# EAGLE design SunnyBuddy (EAGLE 9.6.2)

## Sheet 1 of 4
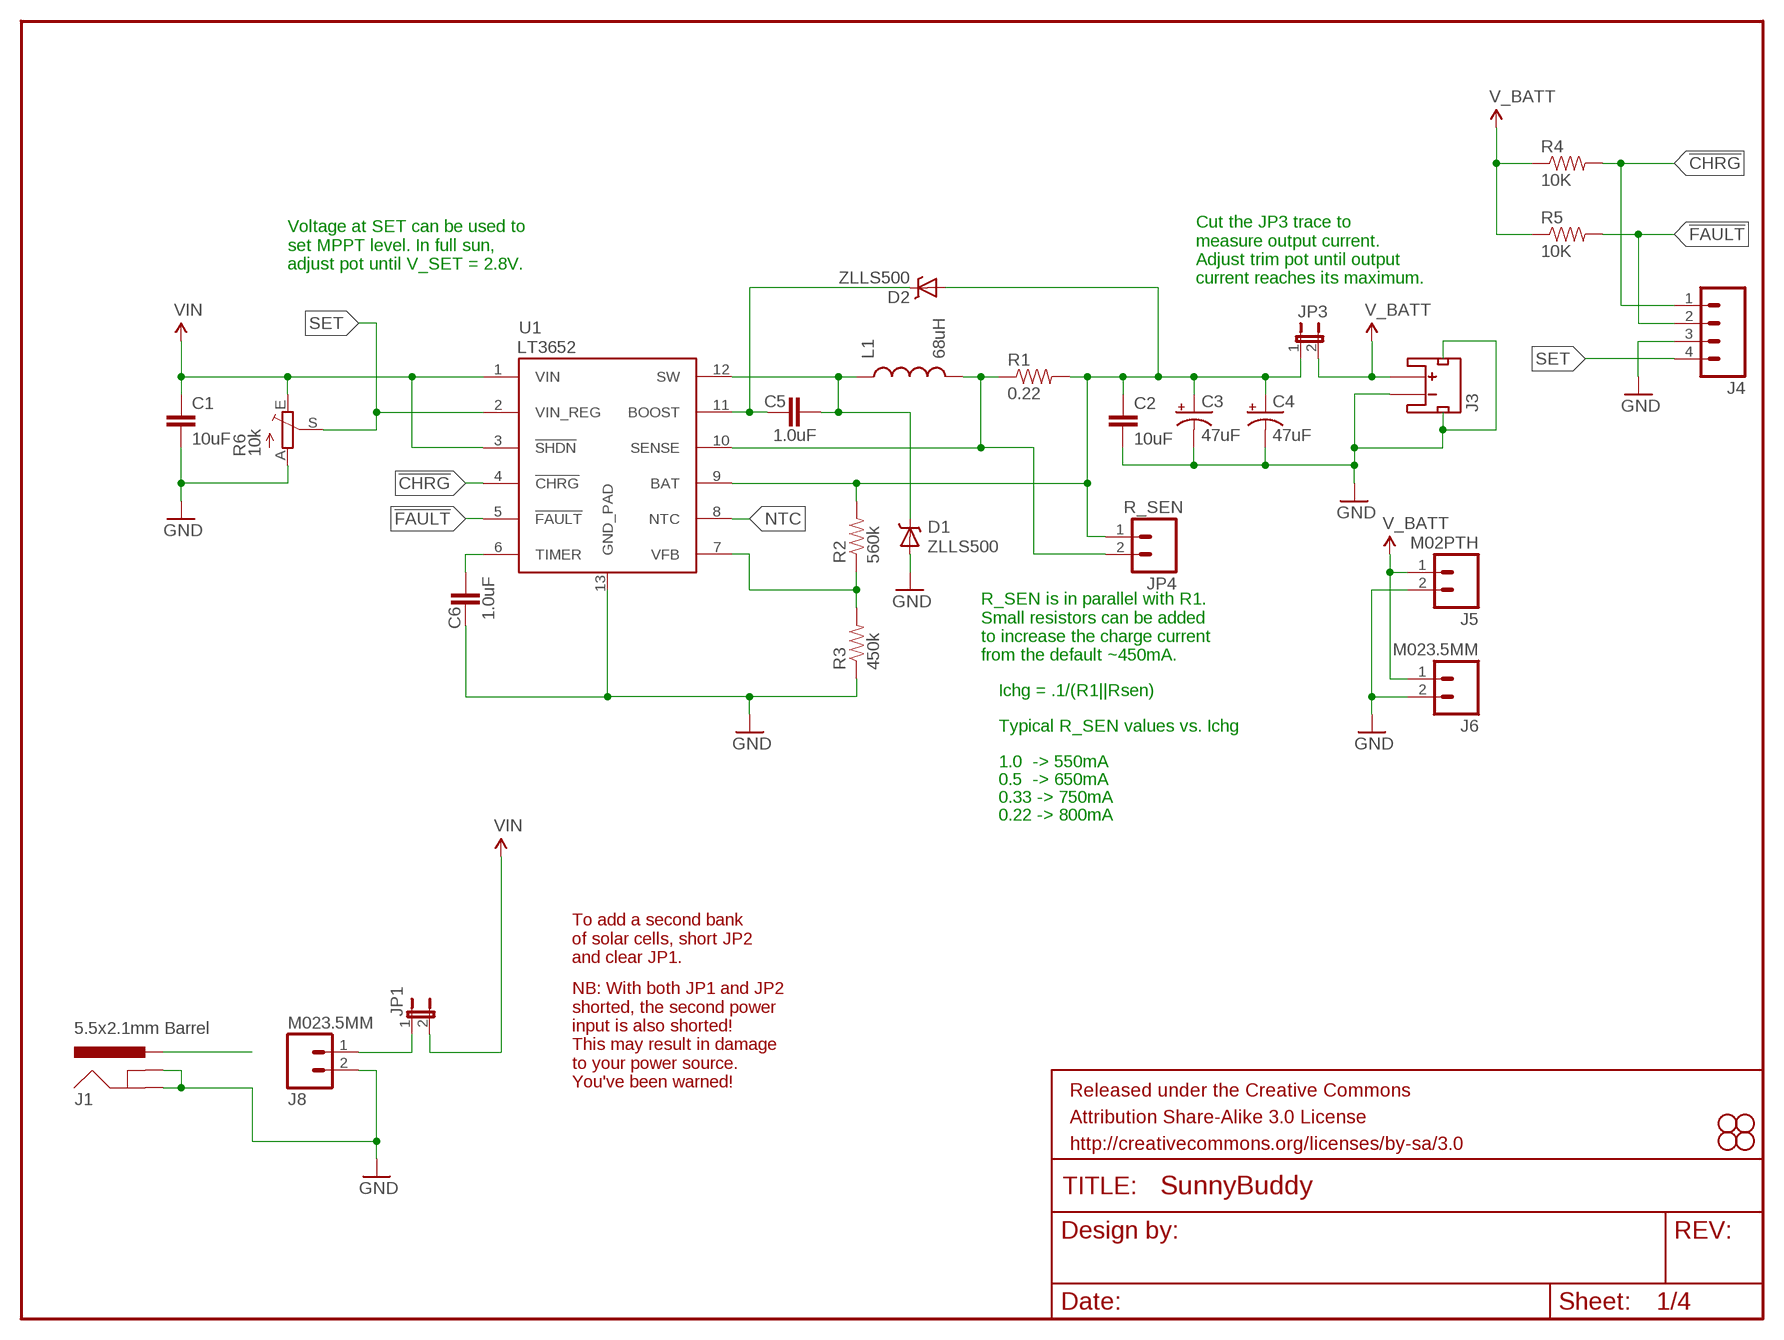
[diagram p0: schematic, sheet 1]

### Parts
C1  10uF  10UF50V20%(1210)  [1210]
C2  10uF  10UF-6.3V-20%(1206)  [1206]
C3  47uF  47UF-TANT  [EIA3528]
C4  47uF  47UF-TANT  [EIA3528]
C5  1.0uF  1.0UF-16V-10%(0603)  [0603-CAP]
C6  1.0uF  1.0UF-16V-10%(0603)  [0603-CAP]
D1  ZLLS500  ZLLS500ZLLS500  [SOT23]
D2  ZLLS500  ZLLS500ZLLS500  [SOT23]
FRAME1  FRAME-LETTER  [CREATIVE_COMMONS]
J1  5.5x2.1mm Barrel  POWER_JACKSMD  [POWER_JACK_SMD]
J3  JST_2MM_MALE  [JST-2-SMD]
J4  M04PTH  [1X04]
J5  M02PTH  [1X02]
J6  M023.5MM  [SCREWTERMINAL-3.5MM-2]
J8  M023.5MM  [SCREWTERMINAL-3.5MM-2]
JP1  JUMPER-2SMD-NC  [SJ_2S]
JP3  JUMPER-PTH-2-NC  [PTH-JUMPER-NC_BOTTOM_NO_SILK]
JP4  R_SEN  M02PTH  [1X02]
L1  68uH  INDUCTOR68UH-1A  [CR75]
R1  0.22  0.22OHM1/4W1%(0805)  [0805]
R2  560k  47KOHM1/10W1%(0603)  [0603-RES]
R3  450k  220KOHM1/10W1%(0603)  [0603-RES]
R4  10K  10KOHM1/10W1%(0603)0603  [0603-RES]
R5  10K  10KOHM1/10W1%(0603)0603  [0603-RES]
R6  10k  TRIM_EU-S63S  [S63S]
STANDOFF1  STAND-OFF  [STAND-OFF]
STANDOFF2  STAND-OFF  [STAND-OFF]
STANDOFF3  STAND-OFF  [STAND-OFF]
STANDOFF4  STAND-OFF  [STAND-OFF]
U1  LT3652  [MSOP-12_GND]

### Nets
!CHRG: J4.1 R4.2 U1.4(!CHRG)
!FAULT: J4.2 R5.2 U1.5(!FAULT)
BOOST: C5.1 D2.3(C) U1.11(BOOST)
FB: R2.1 R3.2 U1.7(VFB)
GND: C1.2 C2.2 C3.C(-) C4.C(-) C6.1 D1.1(A) J1.GND(GNDBREAK) J1.P$4(GND) J3.1(-) J3.NC1(PAD1) J3.NC2(PAD2) J4.3 J5.2 J6.2 J8.2 R3.1 R6.A U1.13(GND_PAD)
N$4: C2.1 C3.A(+) C4.A(+) D2.1(A) JP3.1 JP4.1 R1.2 R2.2 U1.9(BAT)
N$6: J1.VIN0(PWR)
N$8: J8.1 JP1.1
NTC: U1.8(NTC)
SENSE: JP4.2 L1.P$2 R1.1 U1.10(SENSE)
SET: J4.4 R6.S U1.2(VIN_REG)
SW: C5.2 D1.3(C) L1.P$1 U1.12(SW)
TIMER: C6.2 U1.6(TIMER)
V_BATT: J3.2(+) J5.1 J6.1 JP3.2 R4.1 R5.1
VIN: C1.1 JP1.2 R6.E U1.1(VIN) U1.3(!SHDN)

### Notes on the sheet
- Voltage at SET can be used to
  set MPPT level. In full sun,
  adjust pot until V_SET = 2.8V.
- Cut the JP3 trace to
  measure output current.
  Adjust trim pot until output
  current reaches its maximum.
- R_SEN is in parallel with R1.
  Small resistors can be added
  to increase the charge current
  from the default ~450mA.
- Ichg = .1/(R1||Rsen)
- Typical R_SEN values vs. Ichg
- 1.0  -> 550mA
- 0.5  -> 650mA
- 0.33 -> 750mA
- 0.22 -> 800mA
- To add a second bank
  of solar cells, short JP2
  and clear JP1.
- NB: With both JP1 and JP2
  shorted, the second power
  input is also shorted! 
  This may result in damage
  to your power source.
  You've been warned!

## Sheet 2 of 4
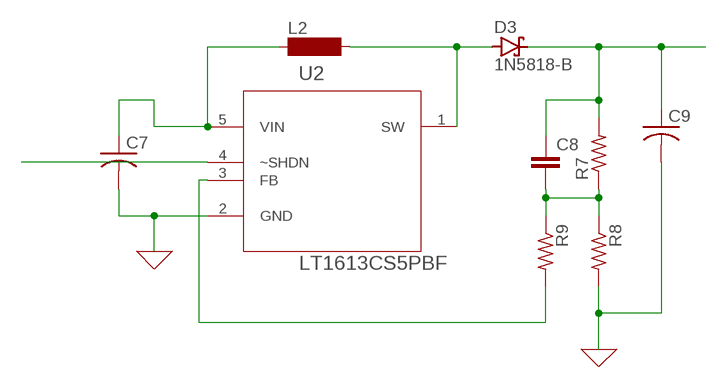
[diagram p1: schematic, sheet 2]

### Parts
C7  C-US050-045X075  [C050-045X075]
C8  C5/2.5  [C5B2.5]
C9  C-US025-024X044  [C025-024X044]
D3  1N5818-B  [DO41-7.6]
L2  SD12-1000  [SD12_1000]
R7  R-US_0204/5  [0204/5]
R8  R-US_0204/5  [0204/5]
R9  R-US_0204/5  [0204/5]
U2  LT1613CS5PBF  [SOT95P280X145-5N]

### Nets
0: C7.2 C9.2 R8.2 U2.2(GND) ; supply symbol labelled GND
N$3: U2.4(~SHDN)
N$5: C7.1 L2.1 U2.5(VIN)
N$7: R9.2 U2.3(FB)
N$9: D3.A L2.2 U2.1(SW)
N$10: C8.1 C9.1 D3.C R7.2
N$11: C8.2 R7.1 R8.1 R9.1

## Sheet 3 of 4
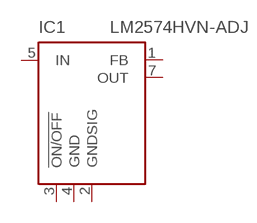
[diagram p2: schematic, sheet 3]

### Parts
IC1  LM2574HVN-ADJ  [DIL08]
Unconnected: IC1.1(FB) IC1.2(GNDSIG) IC1.3(!ON/OFF) IC1.5(IN) IC1.7(OUT)

## Sheet 4 of 4

## Power pins joined to a net without a drawn wire
GND: IC1.4(GND)

## Library data of the parts
C1 = SparkFun-Capacitors:10UF50V20%(1210): CAP-09824; PROD_ID: CAP-09824
C2 = SparkFun-Capacitors:10UF-6.3V-20%(1206): Ceramic CAP-10057; PROD_ID: CAP-10057
C3 C4 = SparkFun-Capacitors:47UF-TANT: 47uF Tantalum SMT CAP-08310- 10V 10% (EIA-3528); PROD_ID: CAP-08310
C5 C6 = SparkFun-Capacitors:1.0UF-16V-10%(0603): CAP-00868; PROD_ID: CAP-00868
C7 C9 = rcl:C-US: CAPACITOR, American symbol; SPICEPREFIX: C
C8 = capacitor-wima:C: CAPACITOR naming: grid - package width
D1 D2 = SparkFun-DiscreteSemi:ZLLS500: 700mA 40V SOT-23 Schottky; PROD_ID: DIO-08411
D3 = diode:1N581*: 1.0A SCHOTTKY BARRIER RECTIFIER Source: http://www.diodes.com/datasheets/ds23001.pdf
FRAME1 = SparkFun-Aesthetics:FRAME-LETTER: Schematic Frame Standard 8.5x11 US Letter frame
IC1 = linear:LM2574?-*: SIMPLE SWITCHER 0.5A Step-Down Voltage Regulator Source: http://cache.national.com/ds/LM/LM2574.pdf
J1 = SparkFun-Connectors:POWER_JACK: Power Jack This is the standard 5.5mm barrel jack for power. The PTH is the most common, proven, reliable, footprint. The Slot footprint only works if the mill layer is transmitted to the PCB fab house so be warned. Spark Fun Electronics SKU : PRT-00119 SMT: CONN-08106 Mating wall wart : TOL-00298 (and others); PROD_ID: CONN-08106
J3 = SparkFun-Connectors:JST_2MM_MALE: Mates to single-cell LiPo batteries. CONN-08352; PROD_ID: CONN-08352
J4 = SparkFun-Connectors:M04: Header 4 Standard 4-pin 0.1" header. Use with straight break away headers (SKU : PRT-00116), right angle break away headers (PRT-00553), swiss pins (PRT-00743), machine pins (PRT-00117), and female headers (PRT-00115). Molex polarized connector foot print use with SKU : PRT-08231 with associated crimp pins and housings. 1MM SMD Version SKU: PRT-10208
J5 J6 J8 JP4 = SparkFun-Connectors:M02: Standard 2-pin 0.1" header. Use with - straight break away headers ( PRT-00116) - right angle break away headers (PRT-00553) - swiss pins (PRT-00743) - machine pins (PRT-00117) - female headers (PRT-00115) Molex polarized connector foot print use with: PRT-08233 with associated crimp pins and housings. 2.54_SCREWTERM for use with PRT-10571. 3.5mm Screw Terminal footprints for PRT-08084 5mm Screw Terminal footprints for use with PRT-08433
JP1 = SparkFun-Passives:JUMPER-2: Jumper Basic 0.1" spaced jumper. Use with breakaway headers.
JP3 = SparkFun-Passives:JUMPER-PTH-2-NC
L1 = SparkFun-Passives:INDUCTOR: Inductors Basic Inductor/Choke - 0603 and 1206. Footprints are not proven and vary greatly between part numbers. SRN6045- 33uH, 20% 1.4A SDR0403-560KL - 56uH, 10%, 500mA RMS/740mA peak; PROD_ID: NDUC-09739
L2 = inductor-neosid:SD12: INDUCTOR nominal inductance; OC_FARNELL: unknown; OC_NEWARK: unknown
R1 = SparkFun-Resistors:0.22OHM1/4W1%(0805): RES-09883; PROD_ID: RES-09883
R2 = SparkFun-Resistors:47KOHM1/10W1%(0603): RES-07871; PROD_ID: RES-07871; VALUE: 47K
R3 = SparkFun-Resistors:220KOHM1/10W1%(0603): RES-08969; PROD_ID: RES-08969; VALUE: 220k
R4 R5 = SparkFun-Resistors:10KOHM1/10W1%(0603): RES-00824; PROD_ID: RES-00824
R6 = pot:TRIM_EU-: POTENTIOMETER
R7-R9 = rcl:R-US_: RESISTOR, American symbol; SPICEPREFIX: R
STANDOFF1-STANDOFF4 = SparkFun-Electromechanical:STAND-OFF: #4 Stand Off This is the mechanical footprint for a #4 phillips button head screw. Use the keepout ring to avoid running the screw head into surrounding components. SKU : PRT-00447
U1 = SparkFun-PowerIC:LT3652: LT3652 MPPT Solar Charge Controller 5V-32V smart charger for batteries up to 14.4V
U2 = LTC_By_element14_Batch_1:LT1613CS5PBF: DC/DC Converter; MPN: LT1613CS5#PBF; OC_FARNELL: 1531483; OC_NEWARK: 61M3347; PACKAGE: SOT-23-5; SUPPLIER: Linear Technology

## Board
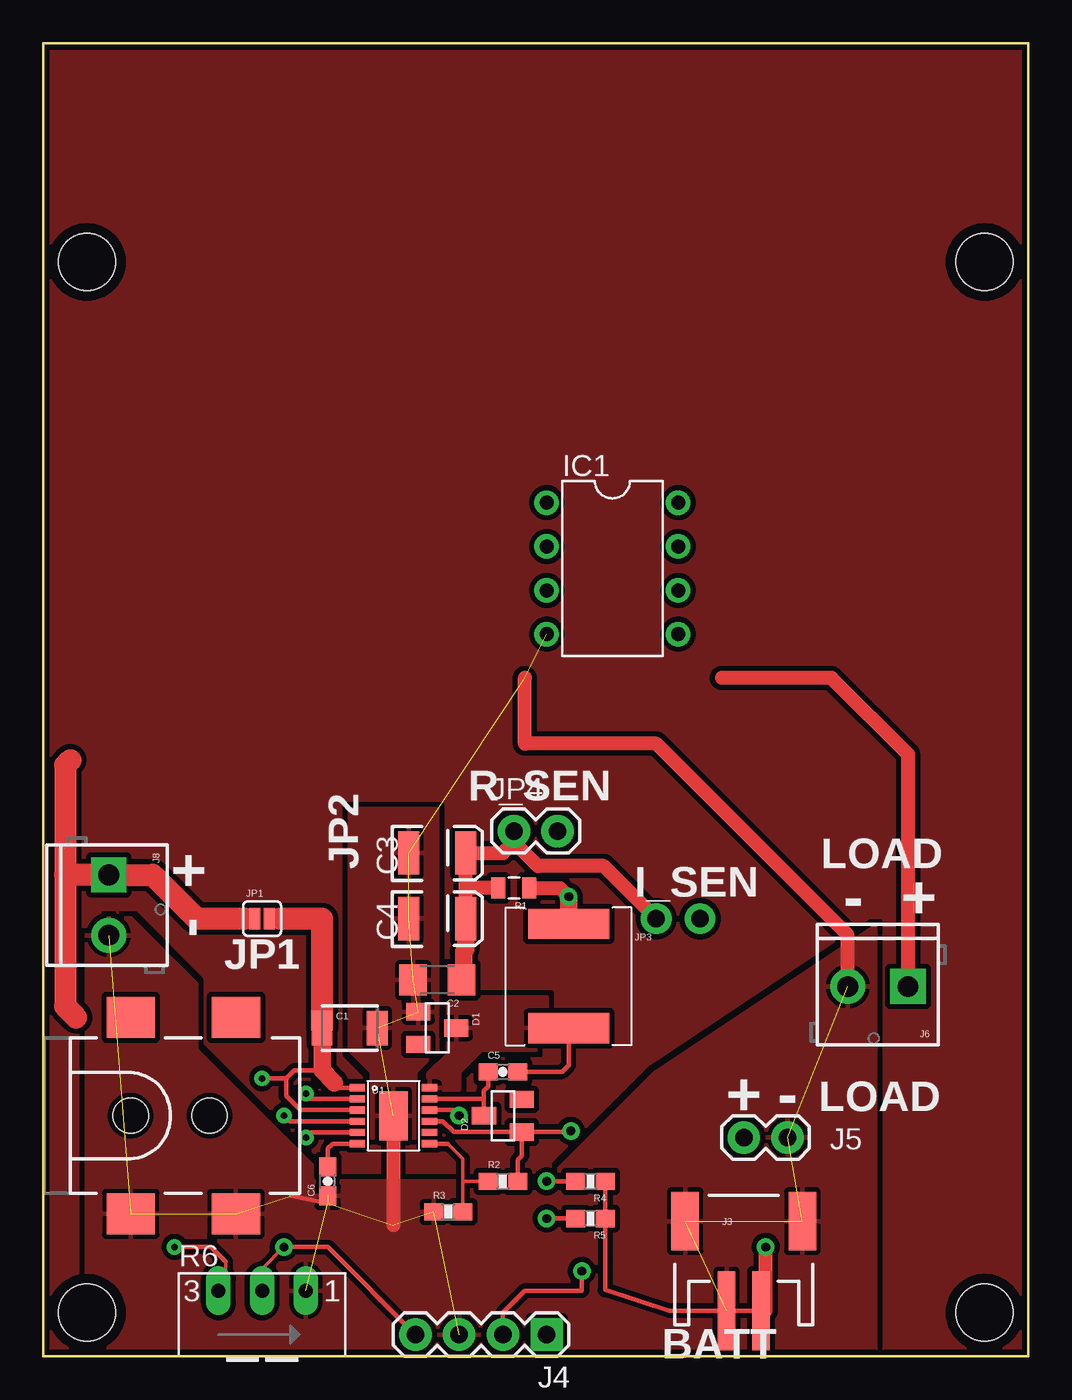
[diagram p3: board, top side]
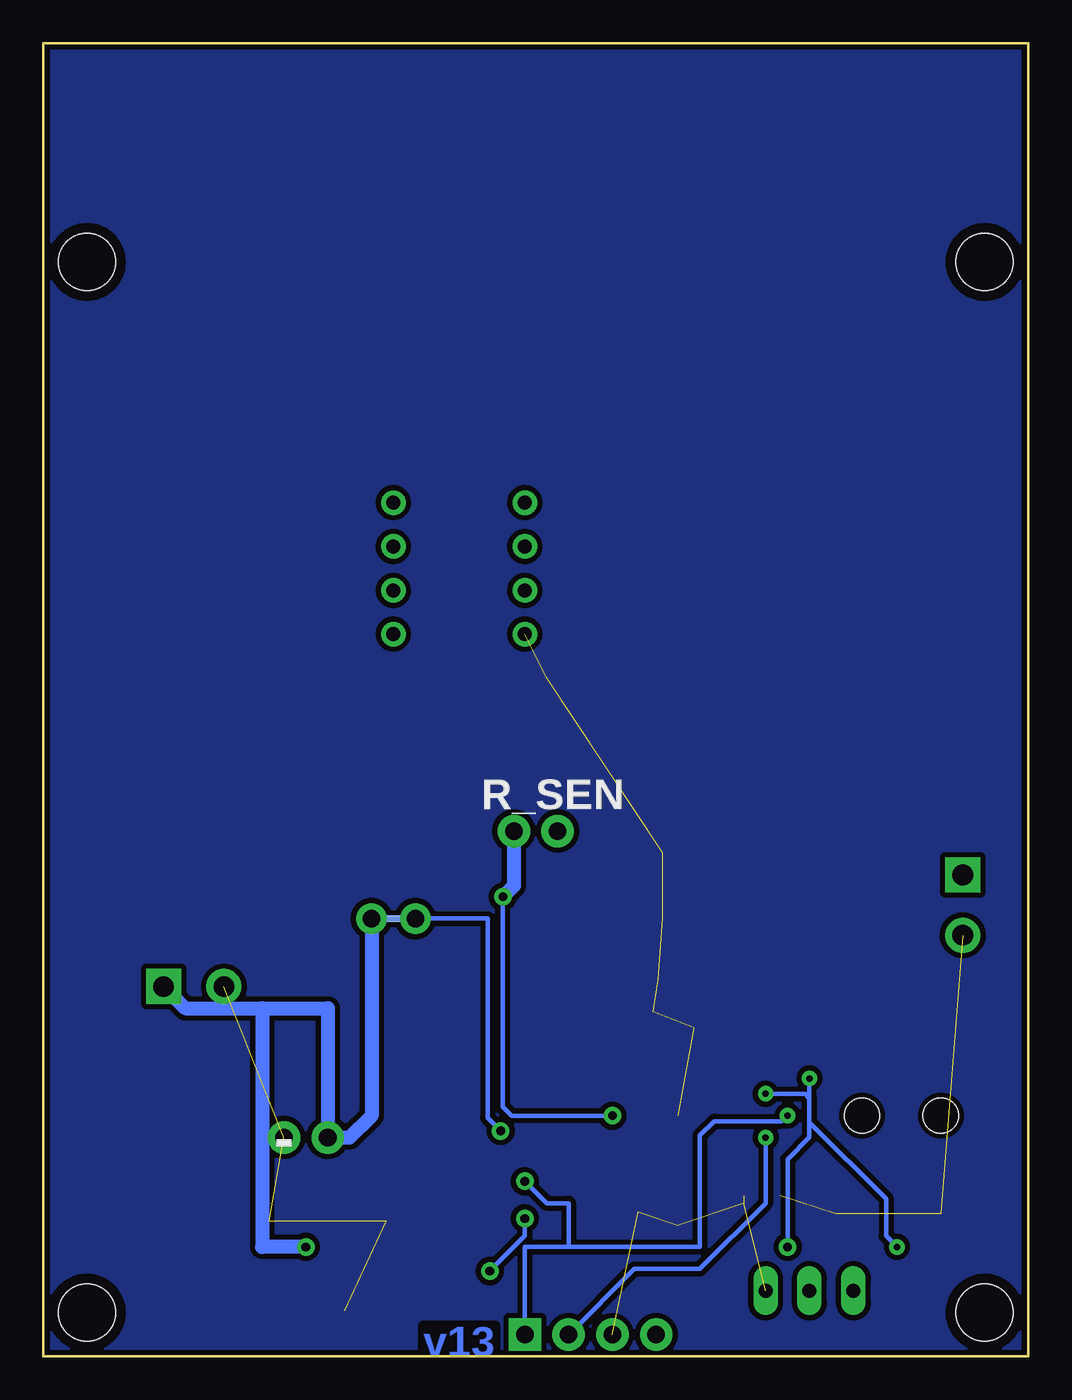
[diagram p4: board, bottom side, seen from below]

Size 57.15 x 76.2 mm. Coordinates in mm from the lower left corner, seen from the top.
Outline: 0,76.2 57.15,76.2 57.15,0 0,0 0,76.2
Copper layers (1*16): Top 0.035mm / dielectric 1.5mm / Bottom 0.035mm
Design rules "Sparkfun": minimum track width 8mil, minimum drill 20mil, track to track 8mil, track to pad 8mil, pad to pad 8mil, via to via 8mil, smd to smd 8mil, copper to edge 8mil, drill to drill 8mil, minimum pad ring 12mil, minimum via ring 10mil, stop-mask expansion 4mil, vias tented up to drill 20mil, thermal gap 10mil

### Footprints (pad centres in the part's own frame; a part is rotated, then mirrored left to right if it is on the bottom)
1210 = smd 1.2 x 2: 1 -1.6,0; 2 1.6,0
1206 = smd 1.6 x 1.8: 1 -1.4,0; 2 1.4,0
EIA3528 = smd 1.2 x 2.5: A 1.65,0; C -1.65,0
0603-CAP = smd 1.1 x 1: 1 -0.85,0; 2 0.85,0
C050-045X075 = drill 0.813 octagon: 1 -2.54,0; 2 2.54,0
C5B2.5 = drill 0.813 pad 1.6 octagon: 1 -2.54,0; 2 2.54,0
C025-024X044 = drill 0.813 octagon: 1 -1.27,0; 2 1.27,0
SOT23 = smd 1 x 1.4: 1 -0.95,-1.1; 2 0.95,-1.1; 3 0,1.1
DO41-7.6 = drill 1.1 pad 1.7: A 3.81,0; C -3.81,0
DIL08 = drill 0.813 pad 1.27: 1 -3.81,-3.81; 2 -1.27,-3.81; 3 1.27,-3.81; 4 3.81,-3.81; 5 3.81,3.81; 6 1.27,3.81; 7 -1.27,3.81; 8 -3.81,3.81
POWER_JACK_SMD = smd 2.8 x 2.4: GND 0,-5.7; P$4 6.1,-5.7; VIN0 0,5.7; VIN1 6.1,5.7 | hole 2.032: 0,0; 4.572,0
JST-2-SMD = smd 1 x 4.6: 1 -1,-3.7; 2 1,-3.7 | smd 1.6 x 3.4: NC1 -3.4,1.5; NC2 3.4,1.5
1X04 = drill 1.016 pad 1.88 square: 1 0,0 | drill 1.016 pad 1.88: 2 2.54,0; 3 5.08,0; 4 7.62,0
1X02 = drill 1.016 pad 1.88: 1 0,0; 2 2.54,0
SCREWTERMINAL-3.5MM-2 = drill 1.2 pad 2.032 square: 1 0,0 | drill 1.2 pad 2.032: 2 3.5,0
SJ_2S = smd 0.635 x 1.27: 1 -0.412,0; 2 0.412,0
PTH-JUMPER-NC_BOTTOM_NO_SILK = drill 1.016 pad 1.778: 1 -1.27,0; 2 1.27,0 | smd 1.27 x 0.381 bottom: P$1 0,0
CR75 = smd 1.75 x 4.7: P$1 0,0; P$2 6.05,0
SD12_1000 = drill 1.1 long: 1 -2.5,0; 2 2.5,0
0805 = smd 0.8 x 1.2: 1 -0.9,0; 2 0.9,0
0603-RES = smd 1.1 x 1: 1 -0.85,0; 2 0.85,0
S63S = drill 0.813 long: A 2.54,1.27; E -2.54,1.27; S 0,1.27
0204/5 = drill 0.813 octagon: 1 -2.54,0; 2 2.54,0
STAND-OFF = hole 3.302: 0,0
MSOP-12_GND = smd 0.889 x 0.42: 1 -2.1,1.625; 2 -2.1,0.975; 3 -2.1,0.325; 4 -2.1,-0.325; 5 -2.1,-0.975; 6 -2.1,-1.625; 7 2.1,-1.625; 8 2.1,-0.975; 9 2.1,-0.325; 10 2.1,0.325; 11 2.1,0.975; 12 2.1,1.625 | smd 1.651 x 2.845: 13 0,0
SOT95P280X145-5N = smd 1.27 x 0.559: 1 -1.295,0.94; 2 -1.295,0; 3 -1.295,-0.94; 4 1.295,-0.94; 5 1.295,0.94

### Placement (x,y rotation side)
C1  17.78,19.05 0 top
C2  22.86,21.84 180 top
C3  22.86,29.21 0 top
C4  22.86,25.4 0 top
C5  26.67,16.51 0 top
C6  16.51,10.16 90 top
C7  -16.51,44.45 0 top  (outside the outline)
C8  -29.21,38.1 0 top  (outside the outline)
C9  -22.86,38.1 0 top  (outside the outline)
D1  22.86,19.05 270 top
D2  26.67,13.97 90 top
D3  -27.94,45.72 0 top  (outside the outline)
FRAME1  46.99,-26.67 0 top  (outside the outline)
IC1  33.02,45.72 270 top
J1  5.08,13.97 0 top
J3  40.64,6.35 0 top
J4  29.21,1.27 180 top
J5  40.64,12.7 0 top
J6  50.16,21.46 180 top
J8  3.81,27.94 270 top
JP1  12.7,25.4 0 top
JP3  36.83,25.4 0 top
JP4  27.3,30.48 0 top
L1  30.48,19.05 90 top
L2  -26.67,67.31 0 top  (outside the outline)
R1  27.3,27.18 180 top
R2  26.67,10.16 0 top
R3  23.5,8.38 0 top
R4  31.75,10.16 180 top
R5  31.75,8 180 top
R6  12.7,2.54 0 top
R7  -16.51,39.37 0 top  (outside the outline)
R8  -8.89,39.37 0 top  (outside the outline)
R9  -29.21,33.02 0 top  (outside the outline)
STANDOFF1  2.54,2.54 0 top
STANDOFF2  2.54,63.5 0 top
STANDOFF3  54.61,63.5 0 top
STANDOFF4  54.61,2.54 0 top
U1  20.32,13.97 0 top
U2  -27.94,54.61 0 top  (outside the outline)

### Tracks (layer width: path | path; a pad name or v marks a point on that pad's centre or on a via)
0  (3 unrouted)
!CHRG  (via drill 0.38, 0.51)
  Top 0.254: R4.2 v29.21,10.16 | U1.4 14.29,13.64 v13.97,13.97
  Bottom 0.254: 26.67,6.35 26.67,8.89 27.94,8.89 v29.21,10.16 | J4.1 29.21,6.35 26.67,6.35 | 26.67,6.35 19.05,6.35 19.05,12.81 U1.4 14.29,13.64 v13.97,13.97
!FAULT  (via drill 0.38, 0.51)
  Top 0.254: v31.24,4.95 31.24,3.81 27.94,3.81 26.67,2.54 J4.2 | R5.2 v29.21,8 | U1.5 15.54,12.99 v15.24,12.7
  Bottom 0.254: v31.24,4.95 29.21,6.99 v29.21,8 | v15.24,12.7 15.24,8.89 19.05,5.08 22.86,5.08 J4.2
BOOST
  Top 0.254: D2.3 25.57,14.86 | 25.57,14.86 25.57,15.41 25.82,15.66 C5.1 | U1.11 25.48,14.95 25.57,14.86
FB
  Top 0.203: 23.47,12.35 24.34,11.47 24.34,10.16 | 24.34,10.16 R3.2 | R2.1 24.34,10.16
  Top 0.254: U1.7 23.47,12.35
GND  (19 unrouted)
  Top 0.254: 14.39,9.31 16.51,8.89
  Top 0.813: U1.13 20.32,7.62 | J6.2 46.66,24.45 35.56,35.56 27.94,35.56 27.94,39.37
  pour Top (isolate 0.305): 48.26,24.98 35.56,16.51 29.21,10.16 16.51,10.16 8.89,17.78 8.89,21.59 5.08,25.4 2.54,25.4 2.54,0 48.26,0
  pour Top (isolate 0.305): 22.86,31.75 22.86,17.78 21.59,16.51 21.59,12.7 19.05,12.7 19.05,16.51 17.78,17.78 17.78,31.75
N$1
  pour Top (isolate 0.305, rank 2, no thermals): 0,76.2 57.15,76.2 57.15,0 0,0
N$2
  pour Bottom (isolate 0.305, rank 2, no thermals): 0,76.2 57.15,76.2 57.15,0 0,0
N$4  (via drill 0.51)
  Top 0.254: U1.9 23.18,13.64 23.81,13.02 D2.1 | 24.13,21.97 C2.1 | D2.1 27.77,11.64 27.52,11.39 R2.2 | v30.61,13.08 30.55,13.02 D2.1
  Top 0.813: C4.A 24.51,27.18 | 24.51,27.18 C3.A 26.67,29.21 27.3,29.84 | 27.3,29.84 JP4.1 | R1.2 24.51,27.18 | JP3.1 32.51,28.45 28.7,28.45 27.3,29.84
  Top 1.016: C4.A 24.51,23.62 24.38,23.5 24.38,21.97 C2.1
  Bottom 0.254: JP3.1 31.37,25.4 31.37,13.84 v30.61,13.08
N$5  (2 unrouted)
N$7  (1 unrouted)
N$8
  Top 0.254: 11.68,25.4 JP1.1
  Top 1.27: 1.58,34.6 1.27,34.29 1.27,27.94 | 1.27,27.94 1.27,20.32 1.92,19.67 | 11.68,25.4 8.89,25.4 6.35,27.94 J8.1 1.27,27.94
N$9  (2 unrouted)
N$10  (3 unrouted)
N$11  (3 unrouted)
SENSE  (via drill 0.51)
  Top 0.254: U1.10 23.8,14.29 v24.13,13.97
  Top 0.813: R1.1 29.97,27.18 v30.48,26.67
  Top 1.016: v30.48,26.67 L1.P$2
  Bottom 0.254: v24.13,13.97 29.97,13.97 30.48,14.48 v30.48,26.67
  Bottom 0.813: JP4.2 29.84,27.3 v30.48,26.67
SET  (via drill 0.38, 0.51)
  Top 0.203: v13.97,6.35 12.7,5.08 R6.S
  Top 0.254: U1.2 15.54,14.95 v15.24,15.24 | J4.4 16.51,6.35 v13.97,6.35
  Bottom 0.254: v15.24,15.24 12.95,15.24 12.7,14.99 12.7,12.7 13.97,11.43 v13.97,6.35
SW
  Top 0.254: C5.2 30.1,16.51 30.48,16.89 L1.P$1
  pour Top (isolate 0.305): 23.5,20.83 29.21,20.83 29.21,18.41 28.57,17.78 25.4,17.78 24.13,16.51 24.13,15.49 22.35,15.49 22.35,16.38 23.5,17.53
TIMER
  Top 0.254: U1.6 16.79,12.35 16.51,12.06 C6.2
V_BATT  (via drill 0.51)
  Top 0.254: R5.1 R4.1 32.6,3.85 36.33,2.65 J3.2
  Top 0.813: J3.2 41.91,2.65 v41.91,6.35 | J6.1 50.16,34.92 45.72,39.37 39.37,39.37
  Bottom 0.813: v41.91,6.35 44.45,6.35 44.45,20.19 | J6.1 48.9,20.19 44.45,20.19 | 44.45,20.19 40.64,20.19 J5.1 39.37,12.7 38.1,13.97 JP3.2
VIN  (via drill 0.38)
  Top 0.203: 10.58,5.5 10.58,4.23 R6.E
  Top 0.254: 13.73,25.39 13.72,25.4 JP1.2 | U1.1 17.17,15.6 16.89,15.88 | U1.3 14.91,14.29 14.1,15.11 14.1,16.13 | 14.1,16.13 14.55,16.59 16.18,16.59 | 10.58,5.5 9.73,6.35 v7.62,6.35 | v12.7,16.13 14.1,16.13
  Top 1.016: C1.1 16.18,16.59 16.89,15.88
  Top 1.27: C1.1 16.18,25.39 13.73,25.39
  Bottom 0.254: v7.62,6.35 8.26,6.99 8.26,9.14 12.7,13.59 v12.7,16.13

### Text on the board
Bottom: v13
tPlace: R_SEN | JP2 | LOAD | + | - | I_SEN | - | + | JP1 | - | LOAD | + | BATT
bPlace: R_SEN | -
tDocu: M. Hord